# EAGLE design NwazetRelayModule (EAGLE 6.1)
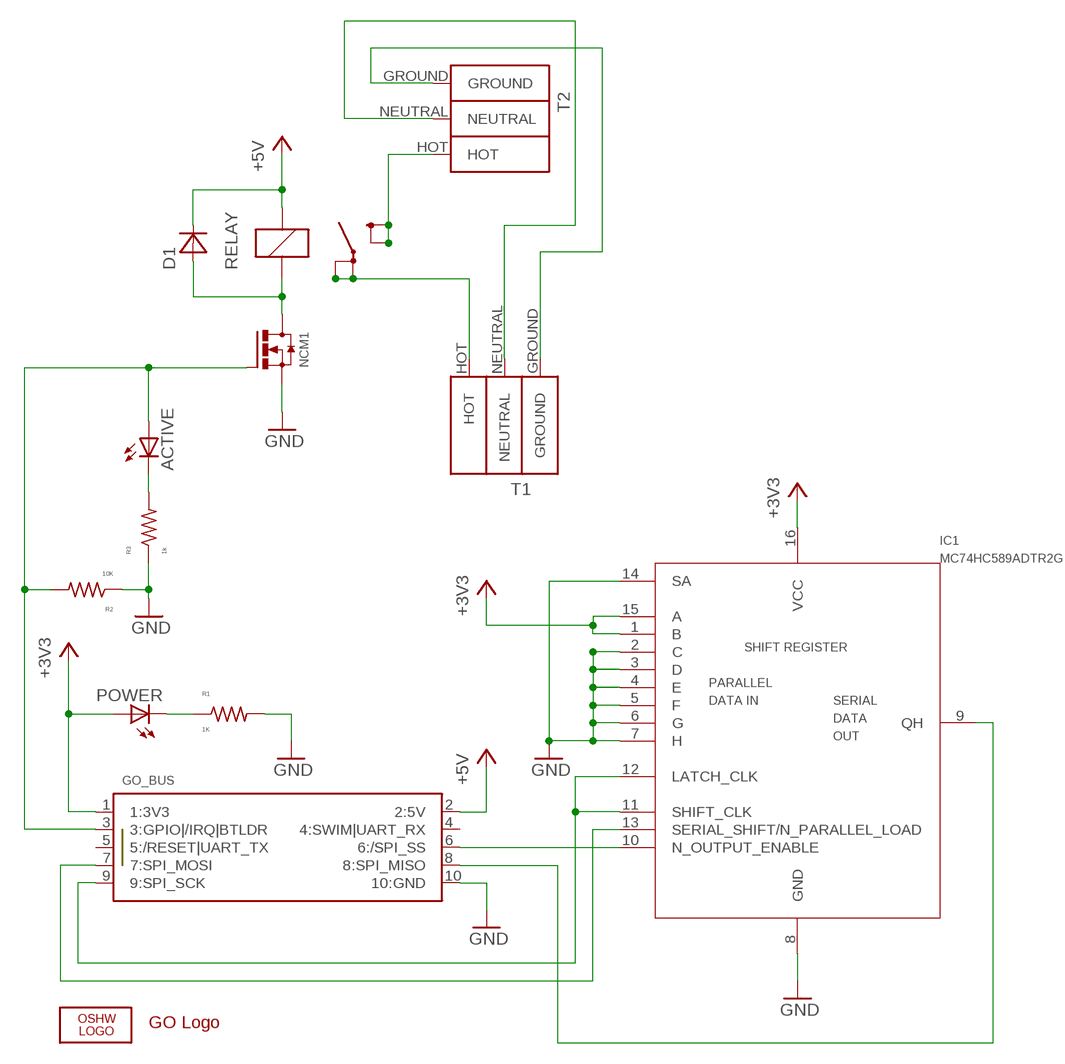
[diagram p0: schematic, sheet 1]

## Parts
ACTIVE  LITEON_WHITE_LED_0805  [0805]
D1  DIODE_POWERDI_323  [DIODE_POWER_DI_323]
GO_BUS  GO_CONNECTOR  [FCI-1.27X1.27MM_10PIN_HEADER_SHROUDED_SMT]
IC1  MC74HC589ADTR2G  [MC74HC589ADTR2G]
LOGO1  OSHW_LOGO_FILLX0100-NT  [OSHW_FILLX100_NOTEXT]
NCM1  PHILIPS_2N7002F_N_CHANNEL_MOSFET  [SOT23]
POWER  LITEON_WHITE_LED_0805  [0805]
R1  1K  RESISTOR_0805  [0805]
R2  10K  RESISTOR_0805  [0805]
R3  1k  RESISTOR_0805  [0805]
RELAY  SCHRACK_POWER_PCB_RELAY_RZ_16A_NO  [SCHRACK_POWER_PCB_RELAY_RZ_16A]
T1  PHOENIX_WIRE_CONTACT_3_POSITIONS  [WIRE_CONTACT_3_POSITIONS]
T2  PHOENIX_WIRE_CONTACT_3_POSITIONS  [WIRE_CONTACT_3_POSITIONS]
U$8  GO_LOGO  [GO_LOGO]

## Nets
+3V3: GO_BUS.1(1:3V3) IC1.1(B) IC1.15(A) IC1.16(VCC) POWER.A
+5V: D1.CATHODE(C) GO_BUS.2(2:5V) RELAY.COIL_A1
GND: GO_BUS.10(10:GND) IC1.2(C) IC1.3(D) IC1.4(E) IC1.5(F) IC1.6(G) IC1.7(H) IC1.8(GND) IC1.14(SA) NCM1.2_SOURCE(SOURCE) R1.K R2.A R3.A
HOT_T1: RELAY.11A_LOAD RELAY.11B_LOAD T1.HOT
HOT_T2: RELAY.14A_LOAD RELAY.14B_LOAD T2.HOT
N$1: ACTIVE.A GO_BUS.3(3:GPIO|/IRQ|BTLDR) NCM1.1_GATE(GATE) R2.K
N$2: ACTIVE.K(C) R3.K
N$3: GO_BUS.9(9:SPI_SCK) IC1.11(SHIFT_CLK) IC1.12(LATCH_CLK)
N$4: GO_BUS.7(7:SPI_MOSI) IC1.13(SERIAL_SHIFT/N_PARALLEL_LOAD)
N$5: GO_BUS.6(6:/SPI_SS) IC1.10(N_OUTPUT_ENABLE)
N$6: GO_BUS.8(8:SPI_MISO) IC1.9(QH)
N$7: POWER.K(C) R1.A
N$8: D1.ANODE(A) NCM1.3_DRAIN(DRAIN) RELAY.COIL_A2
N$9: T1.GROUND T2.GROUND
N$10: T1.NEUTRAL T2.NEUTRAL
Unconnected: GO_BUS.4(4:SWIM|UART_RX) GO_BUS.5(5:/RESET|UART_TX)

## Library data of the parts
ACTIVE POWER = Nwazet.Go:LITEON_WHITE_LED_0805
D1 = Nwazet.Go:DIODE_POWERDI_323
GO_BUS = Nwazet.Go:GO_CONNECTOR
IC1 = Nwazet.Go:MC74HC589ADTR2G: IC SHIFT REGISTER 8BIT 16-TSSOP
LOGO1 = ohw-logo:OSHW_LOGO_FILL
NCM1 = Nwazet.Go:PHILIPS_2N7002F_N_CHANNEL_MOSFET
R1-R3 = Nwazet.Go:RESISTOR_0805
RELAY = Nwazet.Go:SCHRACK_POWER_PCB_RELAY_RZ_16A_NO
T1 T2 = Nwazet.Go:PHOENIX_WIRE_CONTACT_3_POSITIONS
U$8 = Nwazet.Go:GO_LOGO

## Board
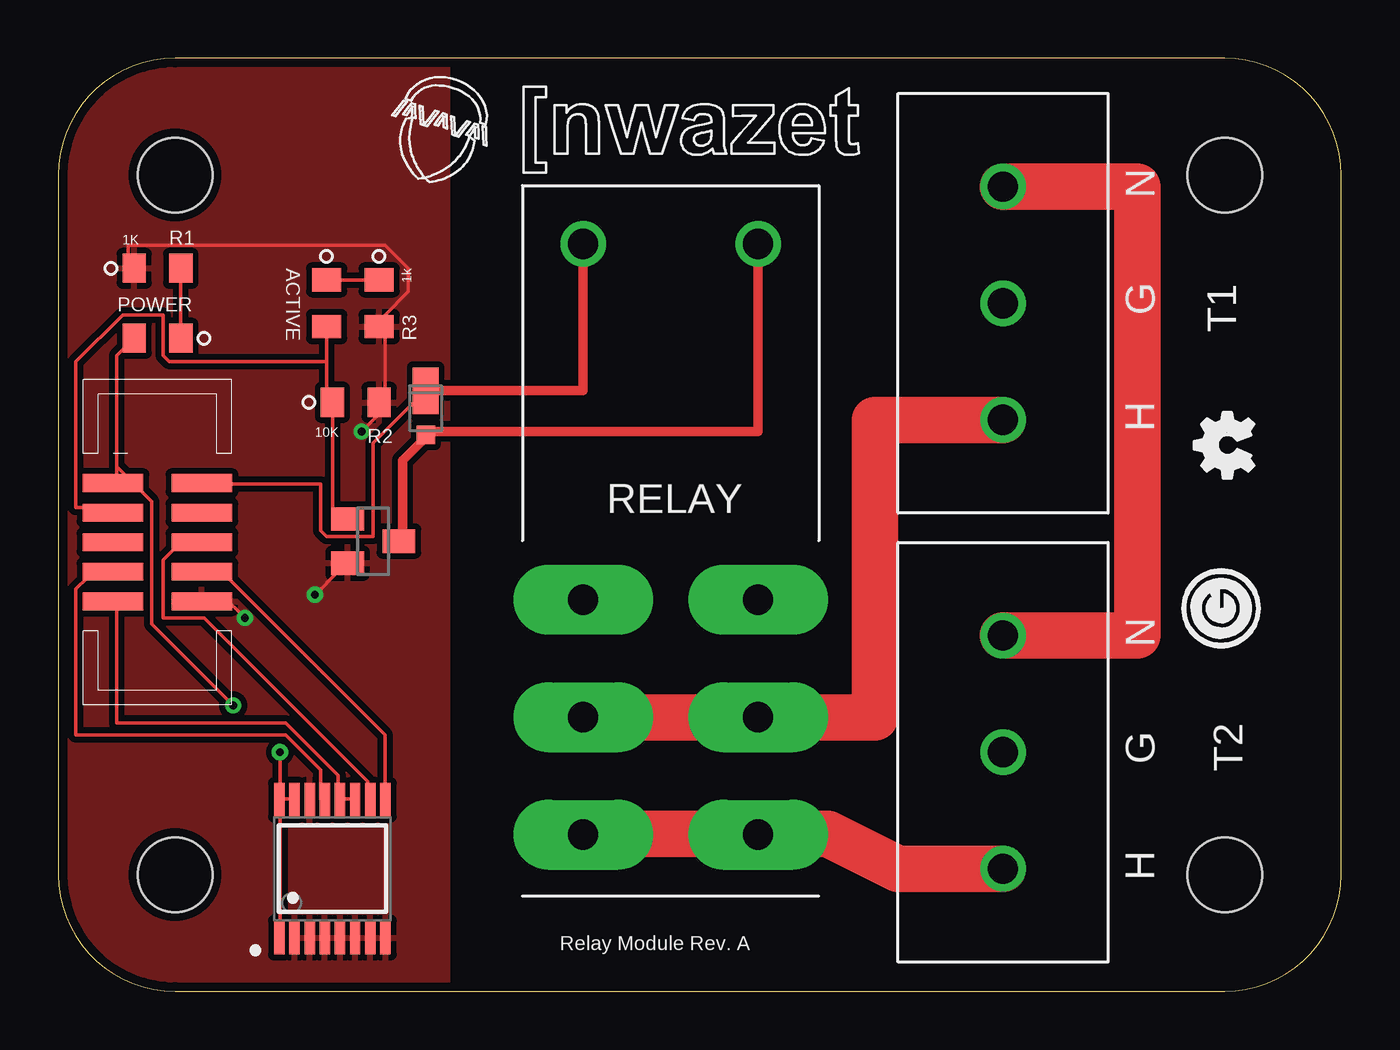
[diagram p1: board, top side]
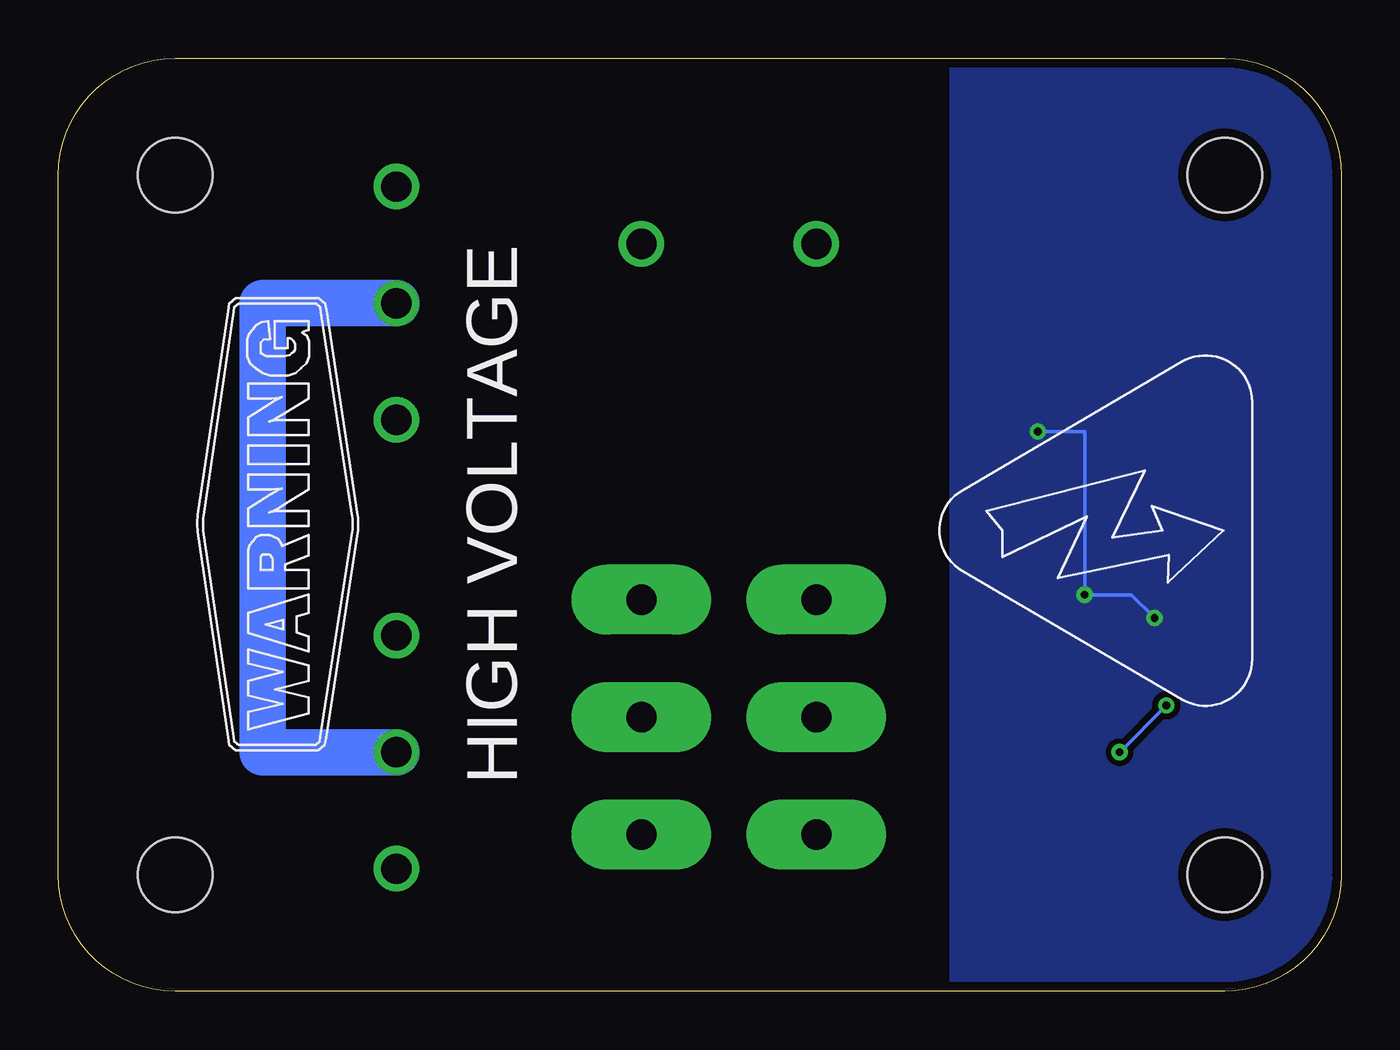
[diagram p2: board, bottom side, seen from below]

Size 55 x 40 mm. Coordinates in mm from the lower left corner, seen from the top.
Outline: 5,0 50,0 arc90 55,5 55,35 arc90 50,40 5,40 arc90 0,35 0,5 arc90 5,0
Copper layers (1*16): Top 0.0356mm / dielectric 1.5011mm / Bottom 0.0356mm
Design rules: minimum track width 6mil, minimum drill 13mil, track to track 6mil, track to pad 6mil, pad to pad 6mil, via to via 6mil, smd to smd 6mil, copper to edge 15mil, drill to drill 6mil, minimum pad ring 7mil, minimum via ring 7mil, stop-mask expansion 4mil, vias tented up to drill 0mil, thermal gap 10mil
Holes 3.2 mm at 5,5 5,35 50,35 50,5

### Footprints (pad centres in the part's own frame; a part is rotated, then mirrored left to right if it is on the bottom)
0805 = smd 1.25 x 1: A 0,1; K 0,-1
DIODE_POWER_DI_323 = smd 0.8 x 0.8: ANODE 0.9,0 | smd 2 x 1.1: CATHODE -1,0
FCI-1.27X1.27MM_10PIN_HEADER_SHROUDED_SMT = smd 0.76 x 2.6: 1 -2.54,-1.905; 2 -2.54,1.905; 3 -1.27,-1.905; 4 -1.27,1.905; 5 0,-1.905; 6 0,1.905; 7 1.27,-1.905; 8 1.27,1.905; 9 2.54,-1.905; 10 2.54,1.905
MC74HC589ADTR2G = smd 1.45 x 0.45: 1 -2.95,2.275; 2 -2.95,1.625; 3 -2.95,0.975; 4 -2.95,0.325; 5 -2.95,-0.325; 6 -2.95,-0.975; 7 -2.95,-1.625; 8 -2.95,-2.275; 9 2.95,-2.275; 10 2.95,-1.625; 11 2.95,-0.975; 12 2.95,-0.325; 13 2.95,0.325; 14 2.95,0.975; 15 2.95,1.625; 16 2.95,2.275
SOT23 = smd 1 x 1.4: 1_GATE -1,-1.1; 2_SOURCE 0.9,-1.1; 3_DRAIN -0.05,1.1
SCHRACK_POWER_PCB_RELAY_RZ_16A = drill 1.3 pad 3 long: 11A_LOAD 0,3.75; 11B_LOAD 0,-3.75; 12A -5.04,3.75; 12B -5.04,-3.75; 14A_LOAD 5.04,3.75; 14B_LOAD 5.04,-3.75 | drill 1.3: COIL_A1 -20.3,-3.75; COIL_A2 -20.3,3.75
WIRE_CONTACT_3_POSITIONS = drill 1.3: GROUND 0,0; HOT -5,0; NEUTRAL 5,0

### Placement (x,y rotation side)
ACTIVE  11.5,29.5 180 top
D1  15.75,24.75 270 top
GO_BUS  4.25,19.25 270 top
IC1  11.75,5.25 90 top
LOGO1  51.25,22 90 top
NCM1  13.5,19.25 270 top
POWER  4.25,28 90 top
R1  4.25,31 270 top
R2  12.75,25.25 270 top
R3  13.75,29.5 180 top
RELAY  26.25,11.75 270 top
T1  40.5,29.5 90 top
T2  40.5,10.25 90 top
U$8  50,16.5 90 top

### Tracks (layer width: path | path; a pad name or v marks a point on that pad's centre or on a via)
+3V3  (via drill 0.33)
  Top 0.152: IC1.1 9.5,2.5 9.5,8 IC1.16 | 9.5,8.25 10,8.25 IC1.15 | 9.5,8.25 IC1.16 | POWER.A 2.5,27.25 2.5,22.5 | 2.5,22.5 2.5,22 GO_BUS.1 | v9.5,10.25 9.5,8.25 | v7.5,12.25 4,15.75 4,21 2.5,22.5 | 9.5,8.25 IC1.16
  Bottom 0.152: v7.5,12.25 v9.5,10.25
+5V
  Top 0.152: 22.5,32 RELAY.COIL_A1 | D1.CATHODE 13.5,23.5 13.5,19.5 11.5,19.5 11.25,19.75 11.25,21.75 6.25,21.75 GO_BUS.2
  Top 0.4: D1.CATHODE 22.5,25.75 22.5,32
GND  (via drill 0.33)
  Top 0.152: v8,16 7,17 GO_BUS.10 | v11,17 12,18 NCM1.2_SOURCE | 14,25 14,29 15,30 15,31 14,32 3,32 3,31 R1.K | 14,25 R2.A 14,25 | 14,25 v13,24
  Bottom 0.152: v8,16 9,17 v11,17 11,24 v13,24
  pour Bottom (isolate 0.254): 16.75,39.75 5.29,39.75 arc90 0.29,34.75 0.26,5.26 arc90 5.26,0.25 16.75,0.25
  pour Top (isolate 0.254): 16.75,39.75 5.22,39.75 arc90 0.22,34.74 0.28,5.24 arc90 5.28,0.25 16.75,0.25
HOT_T1
  Top 0.152: RELAY.11B_LOAD 22.75,12 22.75,11.75
  Top 1: RELAY.11B_LOAD 22.75,11.75
  Top 2: 22.75,11.75 RELAY.11A_LOAD 35,11.75 35,24.5 T1.HOT
HOT_T2
  Top 0.152: RELAY.14B_LOAD 22.75,7 22.75,6.75 | 30,6.75 RELAY.14A_LOAD
  Top 1: 22.5,6.75 22.75,6.75
  Top 2: 22.75,6.75 30,6.75 33,6.75 36,5.25 T2.HOT
N$1
  Top 0.152: ACTIVE.A 11.5,27 | 11.5,27 11.5,25.5 R2.K 11.75,20.75 12.25,20.25 NCM1.1_GATE | 11.5,27 4.75,27 4.5,27.25 4.5,29 2.75,29 0.75,27 0.75,20.75 2.25,20.75 GO_BUS.3
N$2
  Top 0.152: R3.K ACTIVE.K
N$3
  Top 0.152: IC1.11 12.75,8.25 12.25,8.25 IC1.12 12,8.25 12,9.25 9.75,11.5 2.5,11.5 2.5,16.5 GO_BUS.9
N$4
  Top 0.152: IC1.13 11.25,8.25 11.25,9.5 9.75,11 0.75,11 0.75,17.25 1.25,17.75 2.25,17.75 GO_BUS.7
N$5
  Top 0.152: IC1.10 13.25,8.25 13.25,9 6.25,16 4.5,16 4.5,18.5 5.25,19.25 6,19.25 GO_BUS.6
N$6
  Top 0.152: IC1.9 14,8.25 14,11 7.25,17.75 6.25,17.75 GO_BUS.8
N$7
  Top 0.152: R1.A POWER.K
N$8
  Top 0.152: 15.75,23.75 D1.ANODE 15.75,24 | 14.75,19.5 NCM1.3_DRAIN | 30,32 RELAY.COIL_A2
  Top 0.4: 15.75,23.75 14.75,22.75 14.75,19.5 | 15.75,24 30,24 30,32
N$9
  Bottom 2: T2.GROUND 46.25,10.25 46.25,29.5 T1.GROUND
N$10
  Top 2: T2.NEUTRAL 46.25,15.25 46.25,34.5 T1.NEUTRAL

### Text on the board
tPlace: Relay Module Rev. A
bPlace: HIGH VOLTAGE